# EAGLE design Tiny_Programmer_v10 (EAGLE 6.2)
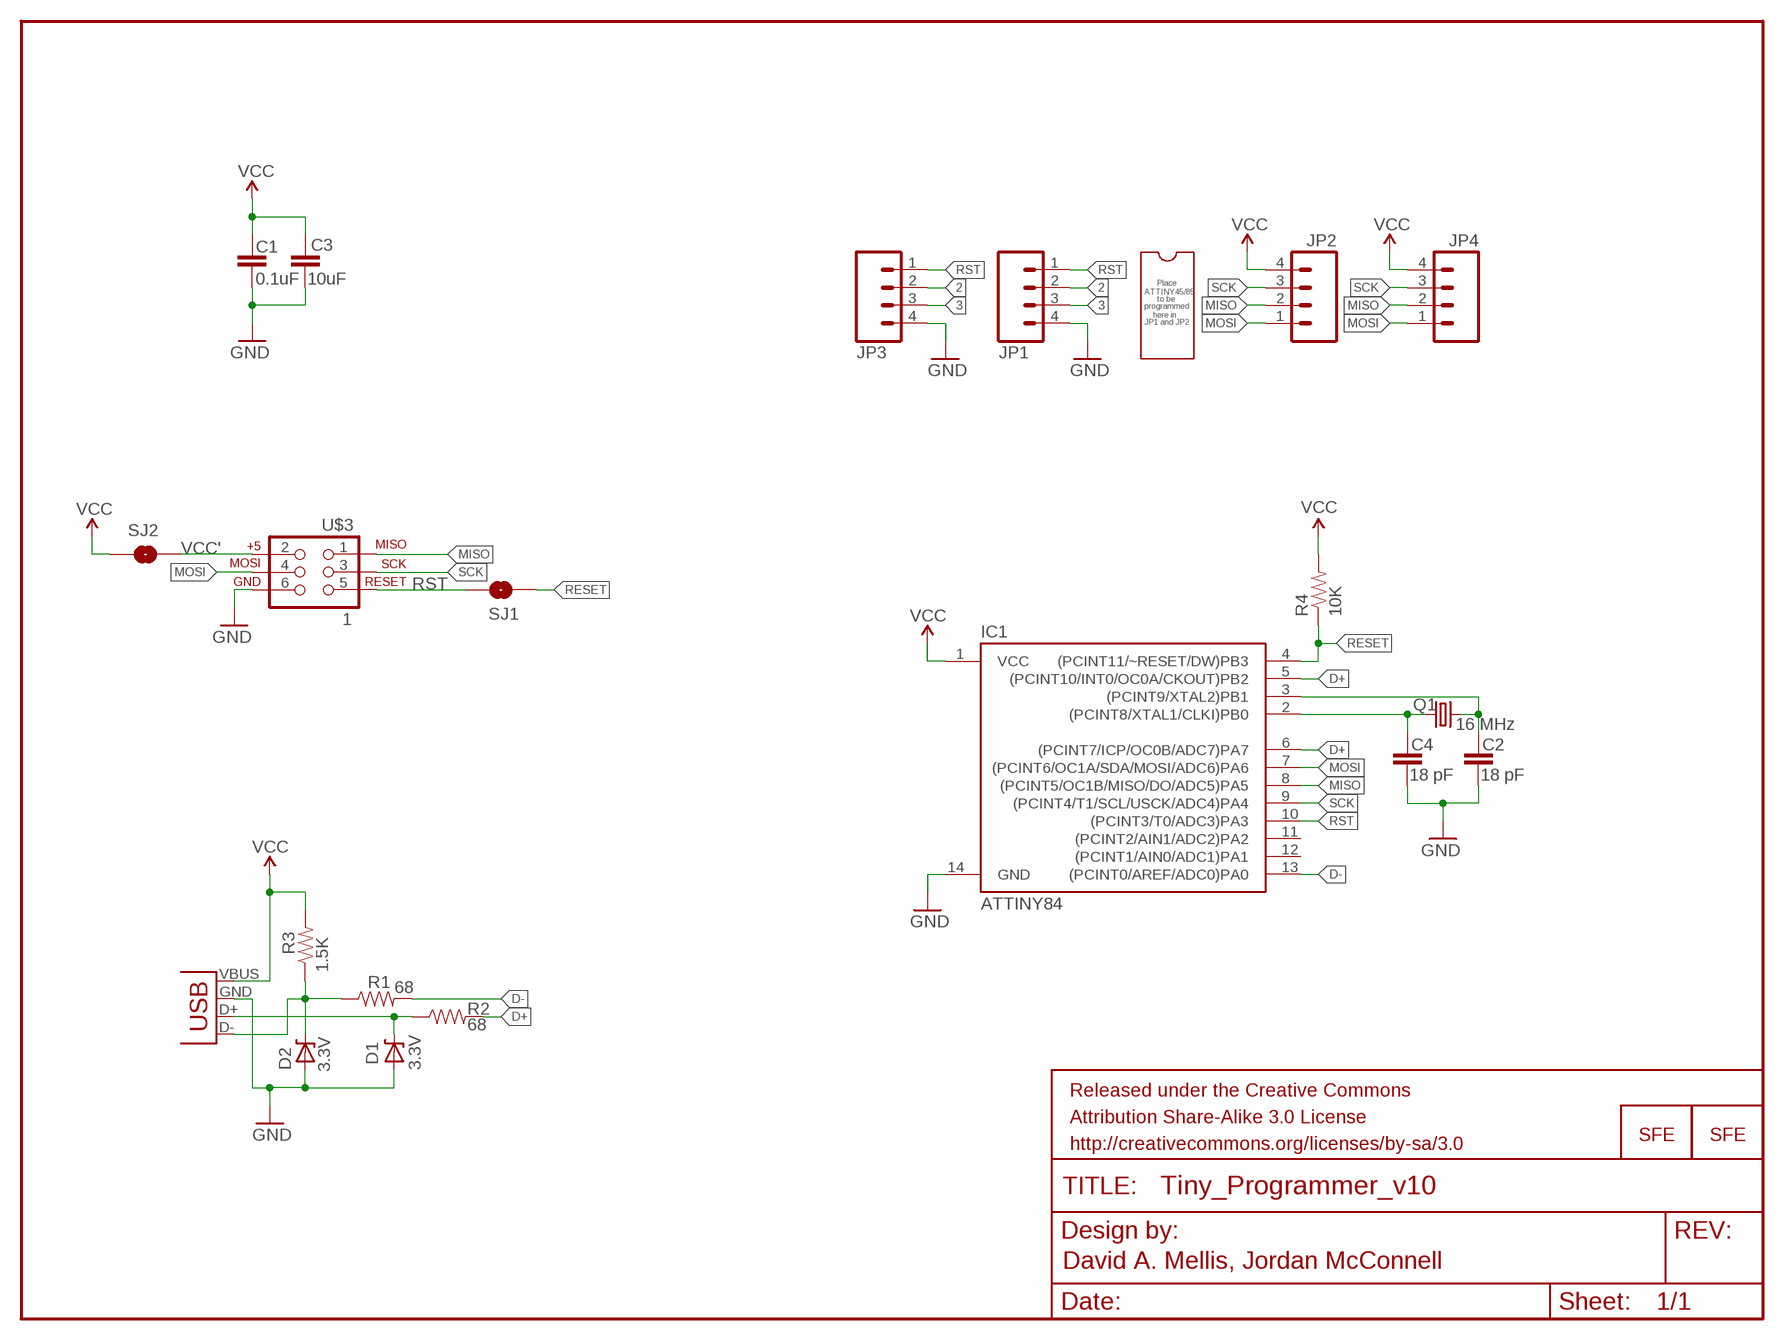
[diagram p0: schematic, sheet 1]

## Parts
C1  0.1uF  CAP0402-CAP  [0402-CAP]
C2  18 pF  CAP0402-CAP  [0402-CAP]
C3  10uF  CAP0402-CAP  [0402-CAP]
C4  18 pF  CAP0402-CAP  [0402-CAP]
D1  3.3V  DIODE-ZENER-BZT52  [SOD-323]
D2  3.3V  DIODE-ZENER-BZT52  [SOD-323]
FRAME1  FRAME-LETTER  [CREATIVE_COMMONS]
IC1  ATTINY84  [SO14]
JP1  M04SMD_STRAIGHT_COMBO  [1X04_SMD_STRAIGHT_COMBO]
JP2  M04SMD_STRAIGHT_COMBO  [1X04_SMD_STRAIGHT_COMBO]
JP3  M04SMD_STRAIGHT_COMBO  [1X04_SMD_STRAIGHT_COMBO]
JP4  M04SMD_STRAIGHT_COMBO  [1X04_SMD_STRAIGHT_COMBO]
JP5  LOGO-SFENEW  [SFE-NEW-WEBLOGO]
JP6  LOGO-SFESK  [SFE-LOGO-FLAME]
Q1  16 MHz  CRYSTAL5X3  [CRYSTAL-SMD-5X3]
R1  68  RESISTOR0402-RES  [0402-RES]
R2  68  RESISTOR0402-RES  [0402-RES]
R3  1.5K  RESISTOR0402-RES  [0402-RES]
R4  10K  RESISTOR0402-RES  [0402-RES]
SJ1  SOLDERJUMPERNO  [SJ_2S-NO]
SJ2  SOLDERJUMPERNO  [SJ_2S-NO]
U$3  1  AVR_SPI_PRG_6PTH  [2X3]
X1  USB-A-H  [USB-A-H]

## Nets
2: JP1.2 JP3.2
3: JP1.3 JP3.3
D+: IC1.5((PCINT10/INT0/OC0A/CKOUT)PB2) IC1.6((PCINT7/ICP/OC0B/ADC7)PA7) R2.2
D-: IC1.13((PCINT0/AREF/ADC0)PA0) R1.2
GND: C1.2 C2.2 C3.2 C4.2 D1.2(A) D2.2(A) IC1.14(GND) JP1.4 JP3.4 U$3.6 X1.GND(VBUS)
MISO: IC1.8((PCINT5/OC1B/MISO/DO/ADC5)PA5) JP2.2 JP4.2 U$3.1
MOSI: IC1.7((PCINT6/OC1A/SDA/MOSI/ADC6)PA6) JP2.1 JP4.1 U$3.4
N$1: D2.1(C) R1.1 R3.1 X1.D-(D+)
N$2: D1.1(C) R2.1 X1.D+(D-)
N$3: C2.1 IC1.3((PCINT9/XTAL2)PB1) Q1.3
N$4: C4.1 IC1.2((PCINT8/XTAL1/CLKI)PB0) Q1.1
RESET: IC1.4((PCINT11/~RESET/DW)PB3) R4.1 SJ1.1
RST: IC1.10((PCINT3/T0/ADC3)PA3) JP1.1 JP3.1 SJ1.2 U$3.5
SCK: IC1.9((PCINT4/T1/SCL/USCK/ADC4)PA4) JP2.3 JP4.3 U$3.3
VCC: C1.1 C3.1 IC1.1(VCC) JP2.4 JP4.4 R3.2 R4.2 SJ2.1 X1.VBUS(GND)
VCC': SJ2.2 U$3.2
Unconnected: IC1.11((PCINT2/AIN1/ADC2)PA2) IC1.12((PCINT1/AIN0/ADC1)PA1)

## Notes on the sheet
- Place
- ATTINY45/85
- to be
- programmed
- here in
- JP1 and JP2
- David A. Mellis, Jordan McConnell

## Library data of the parts
C1-C4 = SparkFun-Passives:CAP: Capacitor Standard 0603 ceramic capacitor, and 0.1" leaded capacitor.
D1 D2 = SparkFun-DiscreteSemi:DIODE-ZENER: Zener Diode Production Part - 8199 3.4V Zener Voltage
FRAME1 = SparkFun-Aesthetics:FRAME-LETTER: Schematic Frame Standard 8.5x11 US Letter frame
IC1 = SparkFun-DigitalIC:ATTINY84: Atmel 14-pin 2/4/8kB flash uC
JP1-JP4 = SparkFun-Connectors:M04: Header 4 Standard 4-pin 0.1" header. Use with straight break away headers (SKU : PRT-00116), right angle break away headers (PRT-00553), swiss pins (PRT-00743), machine pins (PRT-00117), and female headers (PRT-00115). Molex polarized connector foot print use with SKU : PRT-08231 with associated crimp pins and housings. 1MM SMD Version SKU: PRT-10208
JP5 JP6 = SparkFun-Aesthetics:LOGO-SFE: Spark Fun Electronics PCB Logo This is the standard Spark Fun Electronics PCB logo.
Q1 = SparkFun-FreqCtrl:CRYSTAL: Various standard crystals. Proven footprints. Spark Fun Electronics SKU : COM-00534
R1-R4 = SparkFun-Passives:RESISTOR: Resistor Basic schematic elements and footprints for 0603, 1206, and PTH resistors.
SJ1 SJ2 = SparkFun-Passives:SOLDERJUMPER: Solder Jumper Standard SMD solder jumper. Used to automate production. Two varients : Normally Open and Normally Closed are the same, but have different paste layers. NC will have a large amount of paste and should jumper during reflow.
U$3 = SparkFun-Connectors:AVR_SPI_PRG_6: AVR ISP 6 Pin This is the reduced ISP connector for AVR programming. Common on Arduino. This footprint will take up less PCB space and can be used with a 10-pin to 6-pin adapter such as SKU: BOB-08508
X1 = SparkFun-Connectors:USB: USB Connectors USB-B-PTH is fully proven SKU : PRT-00139 USB-miniB is fully proven SKU : PRT-00587 USB-A-PCB is untested. USB-A-H is throughly reviewed, but untested. Spark Fun Electronics SKU : PRT-00437 USB-B-SMT is throughly reviewed, but untested. Needs silkscreen touching up. USB-A-S has not been used/tested USB-MB-H has not been used/tested

## Board
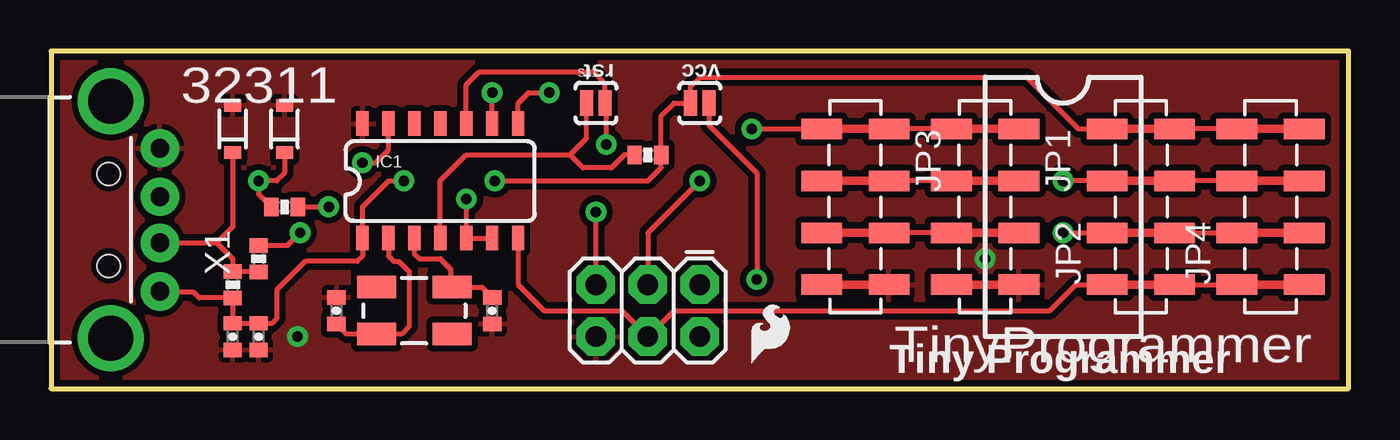
[diagram p1: board, top side]
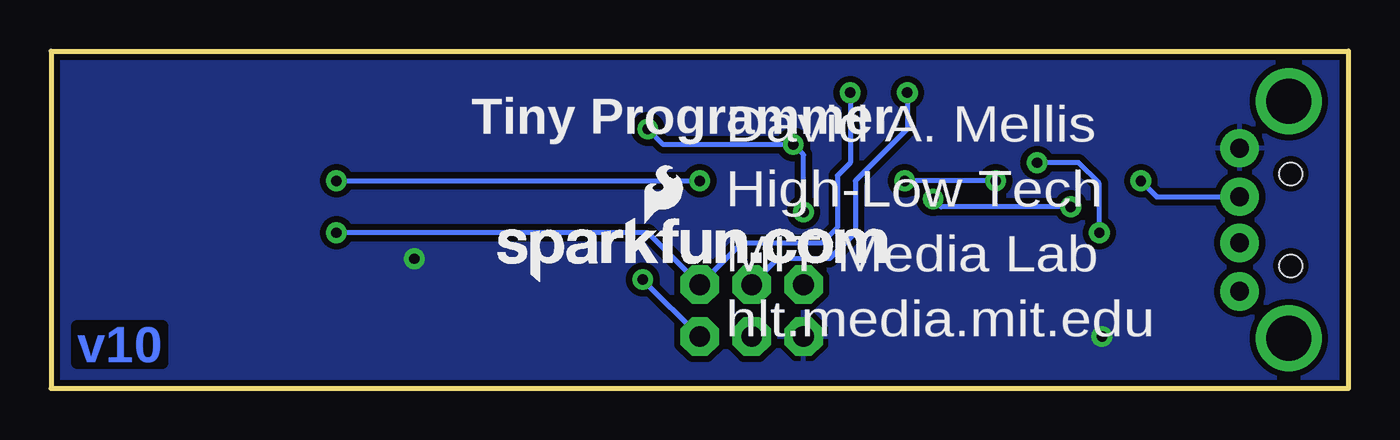
[diagram p2: board, bottom side, seen from below]

Size 63.5 x 16.51 mm. Coordinates in mm from the lower left corner, seen from the top.
Outline: 0,0 63.5,0 63.5,16.51 0,16.51 0,0
Copper layers (1*16): Top 0.035mm / dielectric 1.5mm / Bottom 0.035mm
Design rules: minimum track width 8mil, minimum drill 20mil, track to track 8mil, track to pad 8mil, pad to pad 8mil, via to via 8mil, smd to smd 8mil, copper to edge 8mil, drill to drill 8mil, minimum pad ring 12mil, minimum via ring 10mil, stop-mask expansion 4mil, vias tented up to drill 20mil, thermal gap 10mil

### Footprints (pad centres in the part's own frame; a part is rotated, then mirrored left to right if it is on the bottom)
0402-CAP = smd 0.7 x 0.9: 1 -0.65,0; 2 0.65,0
SOD-323 = smd 0.63 x 0.83: 1 -1.15,0; 2 1.15,0
SO14 = smd 0.6 x 1.2: 1 -3.81,-2.8; 2 -2.54,-2.8; 3 -1.27,-2.8; 4 0,-2.8; 5 1.27,-2.8; 6 2.54,-2.8; 7 3.81,-2.8; 8 3.81,2.8; 9 2.54,2.8; 10 1.27,2.8; 11 0,2.8; 12 -1.27,2.8; 13 -2.54,2.8; 14 -3.81,2.8
1X04_SMD_STRAIGHT_COMBO = smd 1 x 2: 1 0,-1.65; 1-2 0,1.65; 2 2.54,1.65; 2-2 2.54,-1.65; 3 5.08,-1.65; 3-2 5.08,1.65; 4 7.62,1.65; 4-2 7.62,-1.65
CRYSTAL-SMD-5X3 = smd 1.9 x 1.1: 1 -1.85,-1.15; 2 1.85,-1.15; 3 1.85,1.15; 4 -1.85,1.15
0402-RES = smd 0.7 x 0.9: 1 -0.65,0; 2 0.65,0
SJ_2S-NO = smd 0.635 x 1.27: 1 -0.45,0; 2 0.45,0
2X3 = drill 1.016 pad 1.88 octagon: 1 0,0; 2 0,2.54; 3 2.54,0; 4 2.54,2.54; 5 5.08,0; 6 5.08,2.54
USB-A-H = drill 0.914 pad 1.88: D+ 2.4,1.127; D- 2.4,-1.127; GND 2.4,3.5; VBUS 2.4,-3.5 | drill 2.2: GND2 0,-5.8; GND3 0,5.8 | hole 1.1: -0.1,2.25; -0.1,-2.25

### Placement (x,y rotation side)
C1  10.16,2.54 270 top
C2  21.59,3.81 270 top
C3  8.89,2.54 270 top
C4  13.97,3.81 90 top
D1  11.43,12.7 90 top
D2  8.89,12.7 90 top
FRAME1  6.35,-10.16 0 top  (outside the outline)
IC1  19.05,10.16 0 top
JP1  45.72,12.7 270 top
JP2  53.34,5.08 90 top
JP3  39.37,12.7 270 top
JP4  59.69,5.08 90 top
JP5  41.66,5.21 0 bottom
JP6  34.29,1.27 0 top
Q1  17.78,3.81 0 top
R1  10.16,6.35 90 top
R2  11.43,8.89 0 top
R3  8.89,5.08 270 top
R4  29.21,11.43 0 top
SJ1  26.67,13.97 0 top
SJ2  31.75,13.97 0 top
U$3  31.75,5.08 180 top
X1  2.92,8.26 0 top

### Tracks (layer width: path | path; a pad name or v marks a point on that pad's centre or on a via)
2
  Top 0.254: JP1.2 JP3.2
3
  Top 0.254: JP1.3 JP3.3
D+  (via drill 0.51)
  Top 0.254: IC1.6 IC1.5 v20.32,9.27 | R2.2 v13.59,8.89
  Bottom 0.254: v13.59,8.89 19.94,8.89 v20.32,9.27
D-  (via drill 0.51)
  Top 0.254: R1.2 11.57,7 v12.19,7.62 | v15.24,11.05 15.88,11.05 16.51,11.68 IC1.13
  Bottom 0.254: v12.19,7.62 12.19,10.03 13.21,11.05 v15.24,11.05
GND  (via drill 0.51)
  other vias: 45.72,6.35 12.06,2.54
  pour Bottom (isolate 0.305): 0,0 0,16.51 63.5,16.51 63.5,0
  pour Top (isolate 0.305): 0,0 0,16.51 63.5,16.51 63.5,0
MISO  (via drill 0.51)
  Top 0.254: IC1.8 22.86,13.97 23.37,14.48 v24.38,14.48 | v49.53,7.62 JP2.2 JP4.2
  Bottom 0.254: v24.38,14.48 24.38,11.05 25.02,10.41 25.02,7.87 25.78,7.11 29.72,7.11 U$3.1 34.29,7.62 v49.53,7.62
MOSI
  Top 0.254: IC1.7 22.86,5.08 24.13,3.81 27.94,3.81 U$3.4 30.48,3.81 48.9,3.81 50.16,5.08 JP2.1 JP4.1
N$1
  Top 0.254: R1.1 10.13,5.73 R3.1 8.89,6.35 8.11,7.13 | X1.D- 8.11,7.13 | D2.1 8.89,7.91 8.11,7.13
N$2  (via drill 0.51)
  Top 0.254: D1.1 11.43,10.54 11.05,10.16 v10.16,10.16 10.16,9.51 R2.1
  Bottom 0.254: v10.16,10.16 9.38,9.38 X1.D+
N$3
  Top 0.254: IC1.3 17.78,6.6 18.03,6.35 19.05,6.35 19.56,5.84 19.56,5.03 Q1.3 21.09,4.96 C2.1
N$4
  Top 0.254: IC1.2 16.51,6.48 16.76,6.22 17.02,6.22 17.53,5.71 17.53,3.05 17.14,2.67 Q1.1 | Q1.1 | Q1.1 14.46,2.67 C4.1
RESET
  Top 0.254: IC1.4 19.05,10.16 20.32,11.43 25.4,11.43 | 25.4,11.43 26.22,12.25 SJ1.1 | R4.1 28.07,11.43 27.43,10.79 26.04,10.79 25.4,11.43
RST  (via drill 0.51)
  Top 0.254: IC1.10 20.32,14.86 20.95,15.49 26.54,15.49 27.12,14.92 SJ1.2 27.18,13.91 v27.18,11.94 | JP1.1 JP3.1 v34.29,12.7 | U$3.5 v26.67,8.64
  Bottom 0.254: v26.67,8.64 26.67,11.43 v27.18,11.94 33.53,11.94 v34.29,12.7
SCK  (via drill 0.51)
  Top 0.254: IC1.9 v21.59,14.48 | JP4.3 JP2.3 v49.53,10.16 | v31.75,10.16 29.21,7.62 U$3.3
  Bottom 0.254: v21.59,14.48 21.59,12.7 24.13,10.16 24.13,7.62 25.4,6.35 27.94,6.35 U$3.3 | v49.53,10.16 v31.75,10.16
VCC  (via drill 0.51)
  Top 0.254: X1.VBUS 5.38,4.7 6.99,4.7 7.25,4.43 R3.2 C3.1 C1.1 10.18,3.17 10.79,3.17 11.05,3.43 11.05,4.83 12.45,6.22 14.99,6.22 15.24,6.48 IC1.1 15.24,8.89 16.51,10.16 v17.27,10.16 | v21.72,10.16 29.21,10.16 29.86,10.81 R4.2 29.86,13.35 30.48,13.97 SJ2.1 31.3,14.79 31.75,15.24 47.75,15.24 50.29,12.7 JP2.4 JP4.4
  Bottom 0.254: v17.27,10.16 v21.72,10.16
VCC'  (via drill 0.51)
  Top 0.254: SJ2.2 32.2,12.88 34.54,10.54 v34.54,5.33
  Bottom 0.254: v34.54,5.33 U$3.2

### Text on the board
Bottom: v10
tPlace: rst | vcc | Tiny Programmer
bPlace: Tiny Programmer
tNames: 32311 | TinyProgrammer
bNames: David A. Mellis | High-Low Tech | MIT Media Lab | hlt.media.mit.edu
tValues: RST | + | INIT | POWER | 3 | 2 | 4 | 1 | - | 0 | David A. Mellis, Jordan McConnell